# EAGLE design CAN-Bus_Shield (EAGLE 6.5.0)
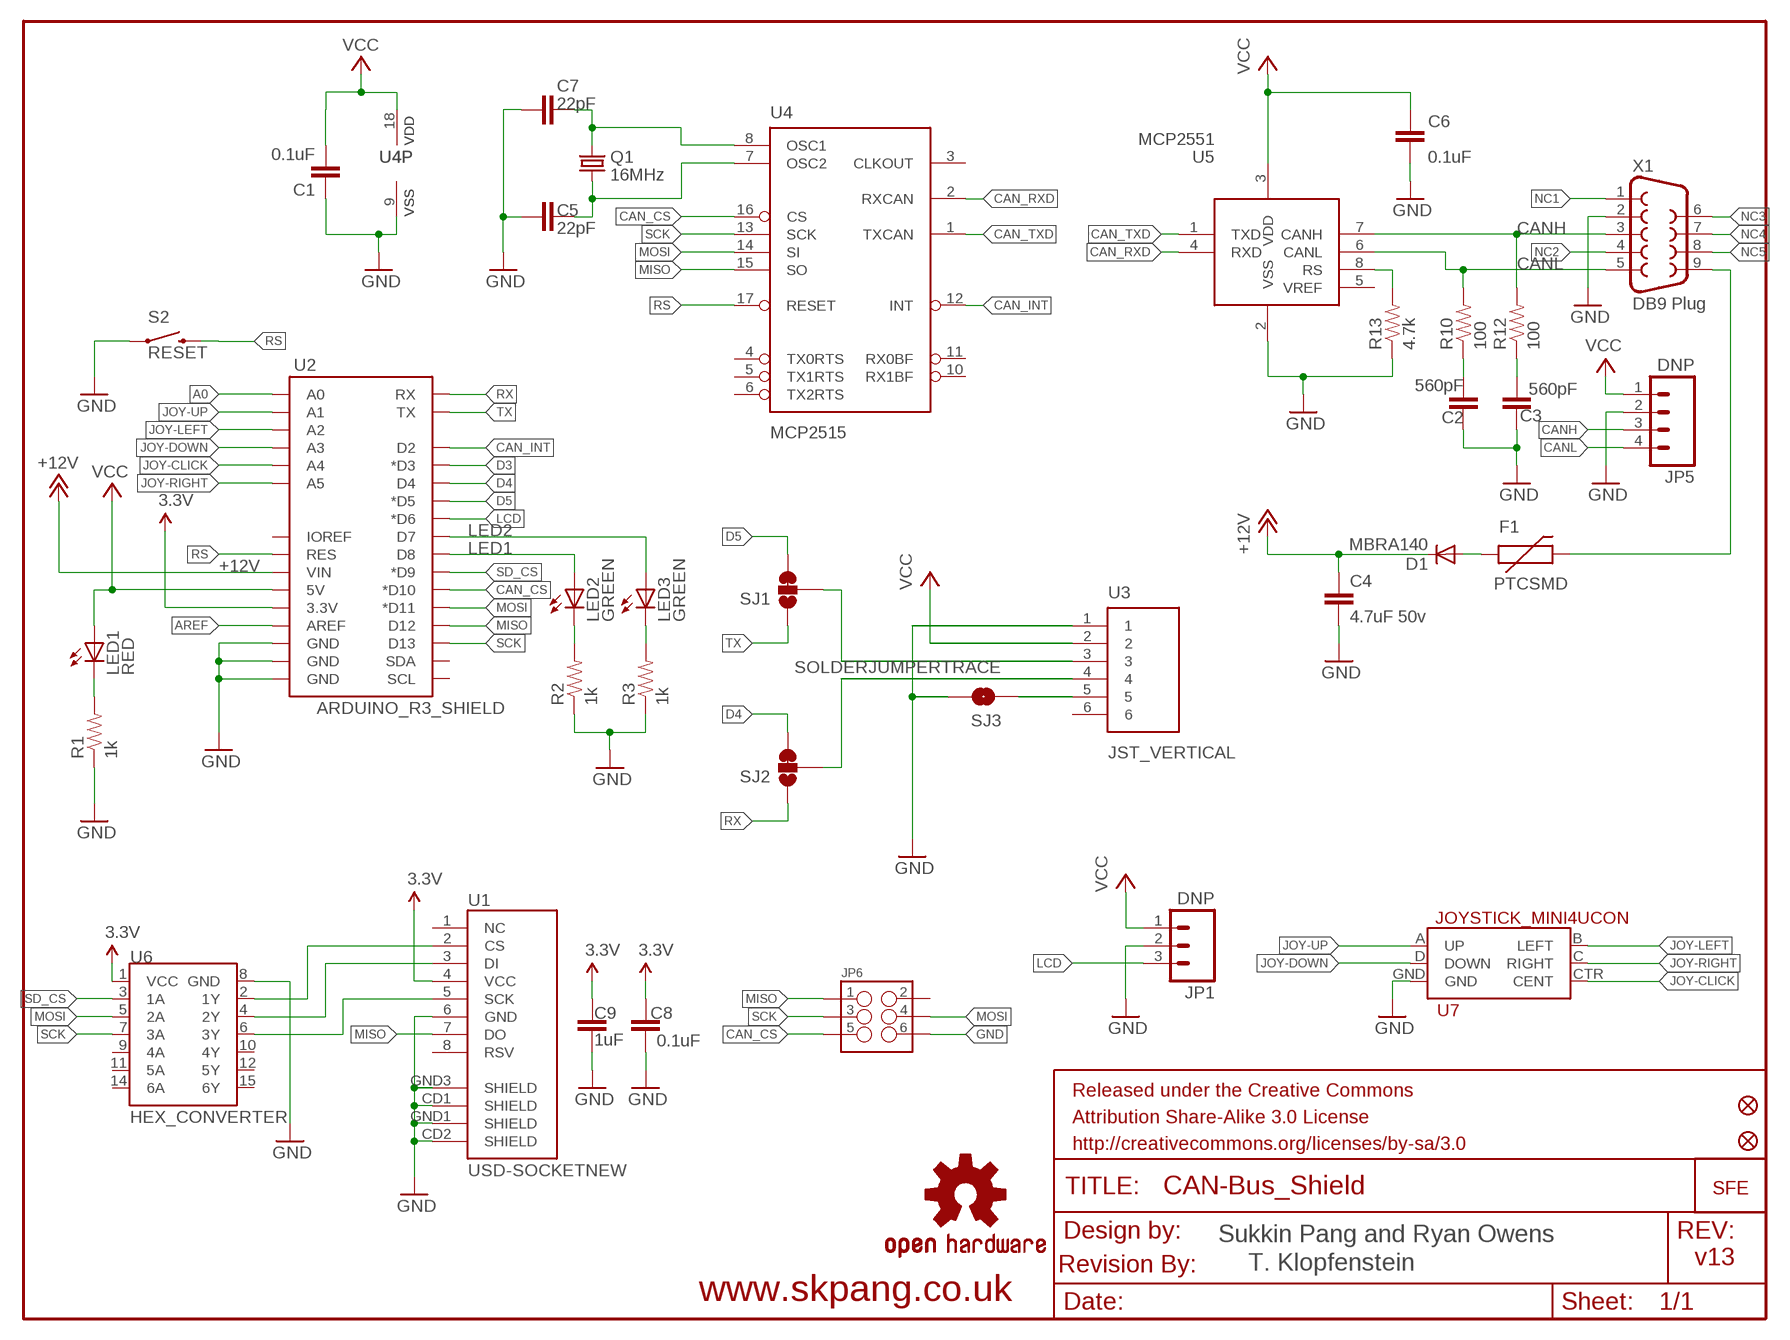
[diagram p0: schematic, sheet 1]

## Parts
C1  0.1uF  CAP0603-CAP  [0603-CAP]
C2  560pF  CAP0603-CAP  [0603-CAP]
C3  560pF  CAP0603-CAP  [0603-CAP]
C4  4.7uF 50v  CAP0603-CAP  [0603-CAP]
C5  22pF  CAP0603-CAP  [0603-CAP]
C6  0.1uF  CAP0603-CAP  [0603-CAP]
C7  22pF  CAP0603-CAP  [0603-CAP]
C8  0.1uF  CAP0603-CAP  [0603-CAP]
C9  1uF  CAP0603-CAP  [0603-CAP]
D1  MBRA140  DIODESMA  [SMA-DIODE]
F1  PTCSMD  [PTC-1206]
FRAME1  FRAME-LETTER  [CREATIVE_COMMONS]
JP1  DNP  M03POLAR_LOCK  [MOLEX-1X3_LOCK]
JP2  FIDUCIAL1X2  [FIDUCIAL-1X2]
JP3  FIDUCIAL1X2  [FIDUCIAL-1X2]
JP4  LOGO-SFENEW  [SFE-NEW-WEBLOGO]
JP5  DNP  M04PTH  [1X04]
JP6  M03X2NO_SILK  [2X3-NS]
LED1  RED  LED0603  [LED-0603]
LED2  GREEN  LED0603  [LED-0603]
LED3  GREEN  LED0603  [LED-0603]
LOGO1  OSHW-LOGOM  [OSHW-LOGO-M]
Q1  16MHz  CRYSTAL5X3  [CRYSTAL-SMD-5X3]
R1  1k  RESISTOR0603-RES  [0603-RES]
R2  1k  RESISTOR0603-RES  [0603-RES]
R3  1k  RESISTOR0603-RES  [0603-RES]
R10  100  RESISTOR0603-RES  [0603-RES]
R12  100  RESISTOR0603-RES  [0603-RES]
R13  4.7k  RESISTOR0603-RES  [0603-RES]
S2  RESET  SWITCH-MOMENTARY-2SMD  [TACTILE_SWITCH_SMD]
SJ1  SOLDERJUMPER_2WAYPASTE2&3  [SJ_3_PASTE2&3]
SJ2  SOLDERJUMPER_2WAYPASTE2&3  [SJ_3_PASTE2&3]
SJ3  SOLDERJUMPERTRACE  [SJ_2S-TRACE]
U1  USD-SOCKETNEW  [MICRO-SD-SOCKET-PP]
U2  ARDUINO_R3_SHIELD  [UNO_R3_SHIELD]
U3  JST_VERTICAL  [JST-6-SMD-VERT-1.0MM]
U4  MCP2515  MCP2510SO  [SO-18W]
U5  MCP2551  [SO-08M]
U6  HEX_CONVERTER  [SO016]
U7  JOYSTICK_MINI4UCON  [JOYSTICK_MINI]
U$1  REVISION  [REVISION]
X1  DB9 Plug  DB9MALE  [DB9_MALE]

## Nets
3.3V: C8.2 C9.1 U1.4(VCC) U2.3.3V U6.1(VCC)
+12V: C4.1 D1.C U2.VIN
A0: U2.A0
AREF: U2.AREF
CAN_CS: JP6.5 U2.D10(*D10) U4.16(CS)
CAN_INT: U2.D2 U4.12(INT)
CAN_RXD: U4.2(RXCAN) U5.4(RXD)
CAN_TXD: U4.1(TXCAN) U5.1(TXD)
CANH: JP5.3 R12.2 U5.7(CANH) X1.3
CANL: JP5.4 R10.2 U5.6(CANL) X1.5
D3: U2.D3(*D3)
D4: SJ2.3 U2.D4
D5: SJ1.3 U2.D5(*D5)
GND: C1.1 C2.1 C3.1 C4.2 C5.1 C6.1 C7.1 C8.1 C9.2 JP1.2 JP5.2 JP6.6 R1.1 R2.1 R3.1 R13.1 S2.1 SJ3.2 U1.6(GND) U1.CD1(SHIELD) U1.CD2(SHIELD) U1.GND1(SHIELD) U1.GND3(SHIELD) U2.GND@0(GND) U2.GND@1(GND) U2.GND@2(GND) U3.1 U4.9(VSS) U5.2(VSS) U6.8(GND) U7.GND X1.2
JOY-CLICK: U2.A4 U7.CTR(CENT)
JOY-DOWN: U2.A3 U7.D(DOWN)
JOY-LEFT: U2.A2 U7.B(LEFT)
JOY-RIGHT: U2.A5 U7.C(RIGHT)
JOY-UP: U2.A1 U7.A(UP)
LCD: JP1.3 U2.D6(*D6)
LED1: LED2.A U2.D8
LED2: LED3.A U2.D7
MISO: JP6.1 U1.7(DO) U2.D12 U4.15(SO)
MOSI: JP6.4 U2.D11(*D11) U4.14(SI) U6.5(2A)
N$1: SJ3.1 U3.5
N$4: LED1.C R1.2
N$5: LED2.C R2.2
N$6: LED3.C R3.2
N$9: C2.2 R10.1
N$10: C3.2 R12.1
N$13: F1.2 X1.9
N$14: R13.2 U5.8(RS)
N$15: U1.2(CS) U6.2(1Y)
N$16: D1.A F1.1
N$17: C7.2 Q1.3 U4.8(OSC1)
N$18: C5.2 Q1.1 U4.7(OSC2)
N$19: U1.3(DI) U6.4(2Y)
N$21: SJ1.2 U3.3
N$22: SJ2.2 U3.4
N$24: U1.5(SCK) U6.6(3Y)
NC1: X1.1
NC2: X1.4
NC3: X1.6
NC4: X1.7
NC5: X1.8
RS: S2.3 U2.RES U4.17(RESET)
RX: SJ2.1 U2.RX
SCK: JP6.3 U2.D13 U4.13(SCK) U6.7(3A)
SD_CS: U2.D9(*D9) U6.3(1A)
TX: SJ1.1 U2.TX
VCC: C1.2 C6.2 JP1.1 JP5.1 LED1.A U2.5V U3.2 U4.18(VDD) U5.3(VDD)
Unconnected: JP6.2 U1.1(NC) U1.8(RSV) U2.IOREF U2.SCL U2.SDA U3.6 U4.3(CLKOUT) U4.4(TX0RTS) U4.5(TX1RTS) U4.6(TX2RTS) U4.10(RX1BF) U4.11(RX0BF) U5.5(VREF) U6.9(4A) U6.10(4Y) U6.11(5A) U6.12(5Y) U6.14(6A) U6.15(6Y)

## Notes on the sheet
- Sukkin Pang and Ryan Owens
- T. Klopfenstein | v13
- www.skpang.co.uk

## Library data of the parts
C1-C9 = SparkFun:CAP: Capacitor Standard 0603 ceramic capacitor, and 0.1" leaded capacitor.
D1 = SparkFun:DIODE: Diode These are standard reverse protection diodes and small signal diodes. SMA package can handle up to about 1A. SOD-323 can handle about 200mA. What the SOD-323 package when ordering, there are some mfgs out there that are 5-pin packages.
F1 = SparkFun:PTC: Resettable Fuse PTC Resettable Fuse. Spark Fun Electronics SKU : COM-08357
FRAME1 = SparkFun-Aesthetics:FRAME-LETTER: Schematic Frame Standard 8.5x11 US Letter frame
JP1 = SparkFun:M03: Header 3 Standard 3-pin 0.1" header. Use with straight break away headers (SKU : PRT-00116), right angle break away headers (PRT-00553), swiss pins (PRT-00743), machine pins (PRT-00117), and female headers (PRT-00115). Molex polarized connector foot print use with SKU : PRT-08232 with associated crimp pins and housings.
JP2 JP3 = SparkFun:FIDUCIAL: Fiducial Alignment Points Various fiducial points for machine vision alignment.
JP4 = SparkFun:LOGO-SFE: Spark Fun Electronics PCB Logo This is the standard Spark Fun Electronics PCB logo.
JP5 = SparkFun:M04: Header 4 Standard 4-pin 0.1" header. Use with straight break away headers (SKU : PRT-00116), right angle break away headers (PRT-00553), swiss pins (PRT-00743), machine pins (PRT-00117), and female headers (PRT-00115). Molex polarized connector foot print use with SKU : PRT-08231 with associated crimp pins and housings.
JP6 = SparkFun-Connectors:M03X2: 2x3 .1" header. Shrouded, with keying- CONN-10681 SMT- CONN-11415 Pogo pins- HW-11044
LED1-LED3 = SparkFun:LED: LEDs Standard schematic elements and footprints for 5mm, 3mm, 1206, and 0603 sized LEDs. 5mm - Spark Fun Electronics SKU : COM-00529 (and others)
LOGO1 = SparkFun-Aesthetics:OSHW-LOGO: Open Source Hardware Logo This logo indicates the piece of hardware it is found on incorporates a OSHW license and/or adheres to the definition of open source hardware found here: http://freedomdefined.org/OSHW
Q1 = SparkFun:CRYSTAL: Crystals Various standard crystals. Proven footprints. Spark Fun Electronics SKU : COM-00534
R1-R3 R10 R12 R13 = SparkFun:RESISTOR: Resistor Basic schematic elements and footprints for 0603, 1206, and PTH resistors.
S2 = SparkFun:SWITCH-MOMENTARY-2
SJ1 SJ2 = SparkFun:SOLDERJUMPER_2WAY: Solder Jumper 2 way solder jumper
SJ3 = SparkFun-Passives:SOLDERJUMPER: Solder Jumper Standard SMD solder jumper. Used to automate production. Two varients : Normally Open and Normally Closed are the same, but have different paste layers. NC will have a large amount of paste and should jumper during reflow.
U1 = SparkFun:USD-SOCKET: microSD Socket Push-push type uSD socket. Schematic element and footprint production proven. Spark Fun Electronics SKU : PRT-00127. tDoc lines correctly indicate media card edge positions when inserting (unlocked, locked, depressed).
U2 = SparkFun-Boards:ARDUINO_R3_SHIELD: Shield form compatible with the Arduino Uno R3.
U3 = SparkFun-Connectors:JST_VERTICAL; PROD_ID: CONN-08249
U4 = microchip_can:MCP2510
U5 = skpang_lib:MCP2551
U6 = SparkFun:HEX_CONVERTER
U7 = SparkFun:JOYSTICK_MINI
U$1 = SparkFun-Aesthetics:REVISION
X1 = SparkFun:DB9: DB9 Connector Standard DB9 (D-Sub 9) serial connector. Can be used for CAN bus as well as RS485 and RS232. Footprint production proven. Spark Fun Electronics SKU : PRT-00429

## Board
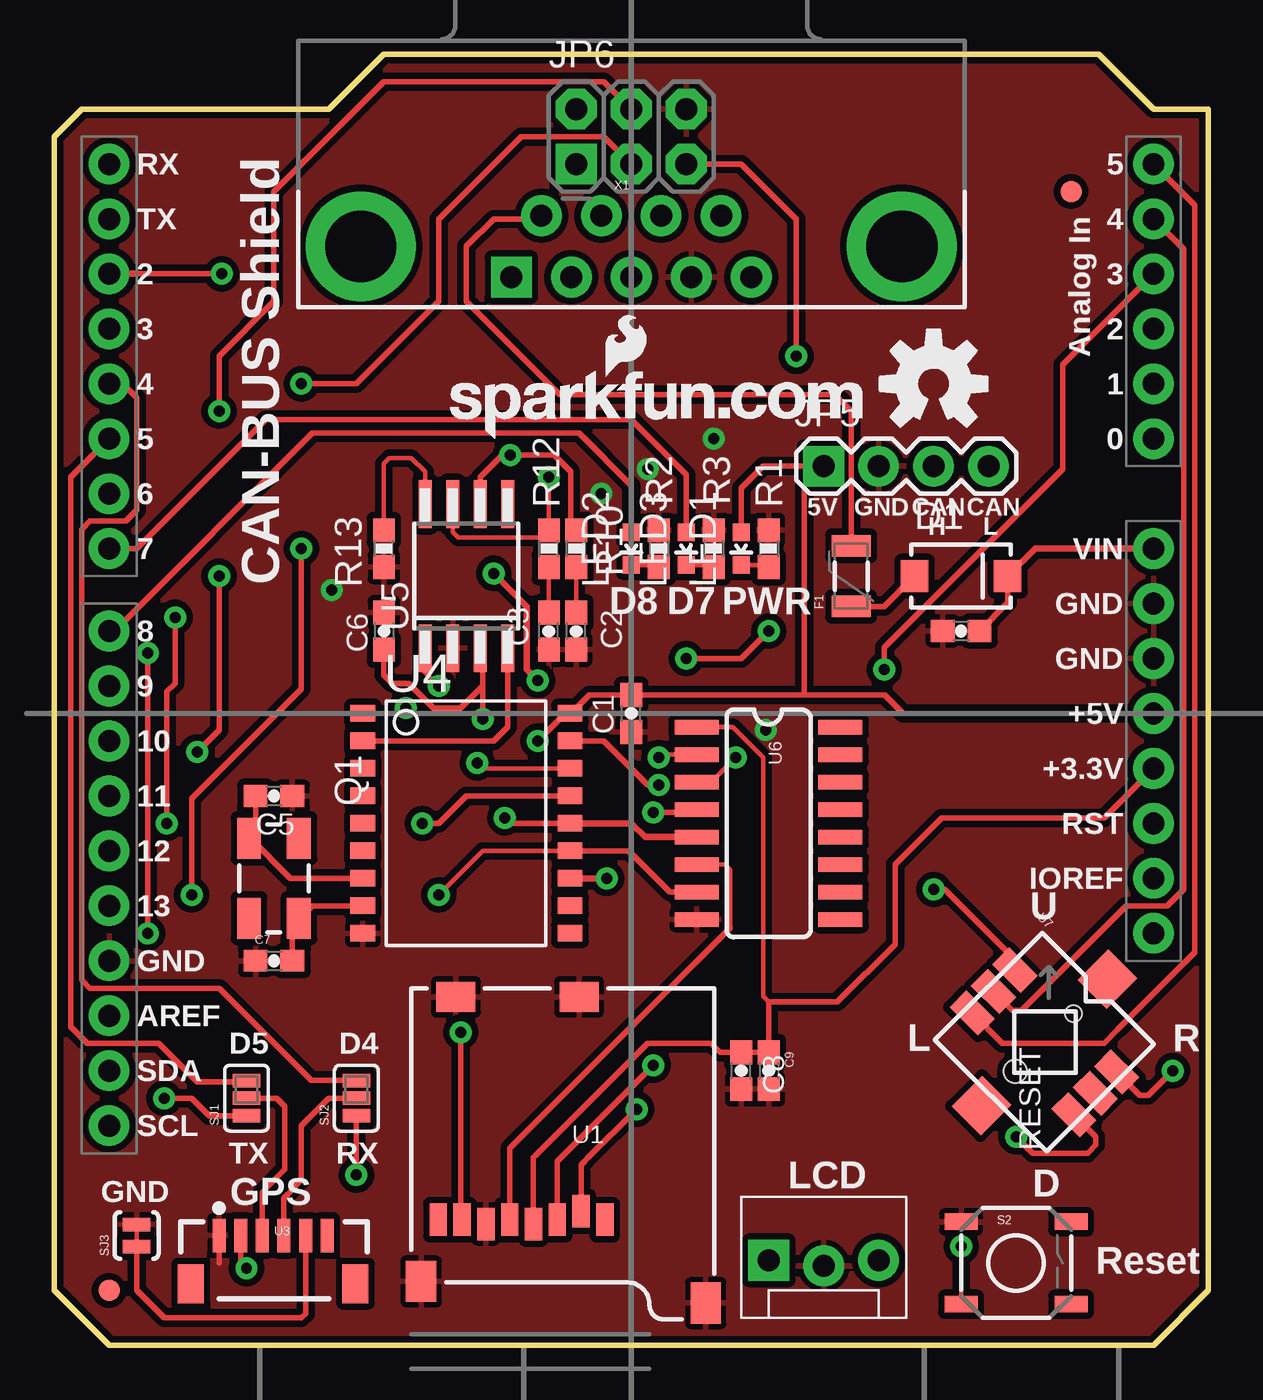
[diagram p1: board, top side]
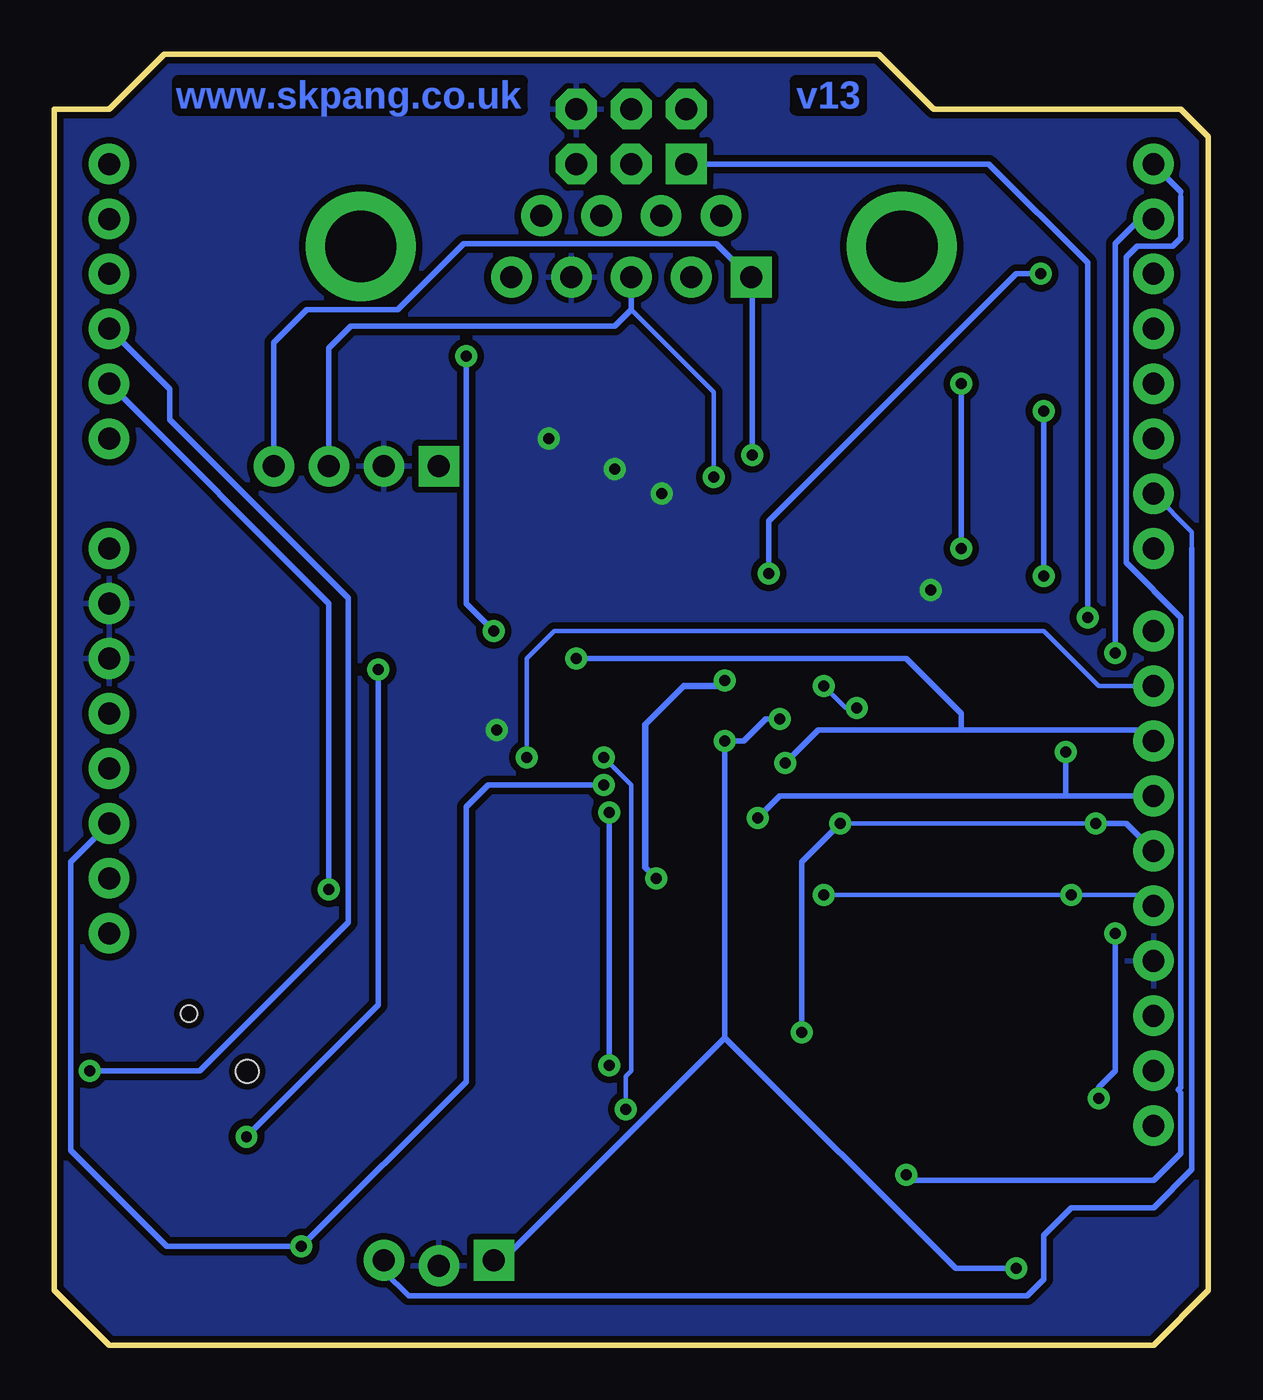
[diagram p2: board, bottom side, seen from below]

Size 53.34 x 59.69 mm. Coordinates in mm from the lower left corner, seen from the top.
Outline: 0,2.54 0,55.88 1.27,57.15 12.7,57.15 15.24,59.69 48.26,59.69 50.8,57.15 53.34,57.15 53.34,2.54 50.8,0 2.54,0 0,2.54
Copper layers (1*16): Top 0.035mm / dielectric 1.5mm / Bottom 0.035mm
Design rules "SparkFun *": minimum track width 8mil, minimum drill 20mil, track to track 8mil, track to pad 8mil, pad to pad 8mil, via to via 8mil, smd to smd 8mil, copper to edge 8mil, drill to drill 8mil, minimum pad ring 12mil, minimum via ring 10mil, stop-mask expansion 4mil, vias tented up to drill 20mil, thermal gap 10mil

### Footprints (pad centres in the part's own frame; a part is rotated, then mirrored left to right if it is on the bottom)
0603-CAP = smd 1.1 x 1: 1 -0.85,0; 2 0.85,0
SMA-DIODE = smd 1.27 x 1.47: A -2.15,0; C 2.15,0
PTC-1206 = smd 1 x 1.8: 1 -1.4,0; 2 1.4,0
MOLEX-1X3_LOCK = drill 1.016 pad 1.88 square: 1 0,0.127 | drill 1.016 pad 1.88: 2 2.54,-0.127; 3 5.08,0.127
FIDUCIAL-1X2 = smd 1 x 1: 1 0,0
1X04 = drill 1.016 pad 1.88 square: 1 0,0 | drill 1.016 pad 1.88: 2 2.54,0; 3 5.08,0; 4 7.62,0
2X3-NS = drill 1.016 pad 1.88 square: 1 -2.54,-1.27 | drill 1.016 pad 1.88 octagon: 2 -2.54,1.27; 3 0,-1.27; 4 0,1.27; 5 2.54,-1.27; 6 2.54,1.27
LED-0603 = smd 0.8 x 0.8: A 0,-0.75; C 0,0.75
CRYSTAL-SMD-5X3 = smd 1.9 x 1.1: 1 -1.85,-1.15; 2 1.85,-1.15; 3 1.85,1.15; 4 -1.85,1.15
0603-RES = smd 1.1 x 1: 1 -0.85,0; 2 0.85,0
TACTILE_SWITCH_SMD = smd 1.524 x 0.762: 1 -2.54,1.905; 2 2.54,1.905; 3 -2.54,-1.905; 4 2.54,-1.905
SJ_3_PASTE2&3 = smd 0.635 x 1.27: 1 -0.813,0; 2 0,0; 3 0.813,0
SJ_2S-TRACE = smd 0.635 x 1.27: 1 -0.508,0; 2 0.508,0
MICRO-SD-SOCKET-PP = smd 0.8 x 1.5: 1 -8.94,10.7; 2 -7.84,10.3; 3 -6.74,10.7; 4 -5.64,10.9; 5 -4.54,10.7; 6 -3.44,10.9; 7 -2.34,10.7; 8 -1.24,10.7 | smd 1.8 x 1.4: CD1 -2.05,0.4; CD2 -7.75,0.4 | smd 1.4 x 1.9: GND1 -13.6,14.55; GND3 -0.45,13.55
UNO_R3_SHIELD = drill 1.016 pad 1.88: 3.3V 50.8,26.67; 5V 50.8,29.21; A0 50.8,41.91; A1 50.8,44.45; A2 50.8,46.99; A3 50.8,49.53; A4 50.8,52.07; A5 50.8,54.61; AREF 2.54,15.24; D2 2.54,49.53; D3 2.54,46.99; D4 2.54,44.45; D5 2.54,41.91; D6 2.54,39.37; D7 2.54,36.83; D8 2.54,33.02; D9 2.54,30.48; D10 2.54,27.94; D11 2.54,25.4; D12 2.54,22.86; D13 2.54,20.32; GND@0 50.8,31.75; GND@1 50.8,34.29; GND@2 2.54,17.78; IOREF 50.8,21.59; NC 50.8,19.05; RES 50.8,24.13; RX 2.54,54.61; SCL 2.54,10.16; SDA 2.54,12.7; TX 2.54,52.07; VIN 50.8,36.83
JST-6-SMD-VERT-1.0MM = smd 0.6 x 1.55: 1 -2.54,1.27; 2 -1.54,1.27; 3 -0.54,1.27; 4 0.46,1.27; 5 1.46,1.27; 6 2.46,1.27 | smd 1.2 x 1.8: P$1 -3.84,-0.955; P$2 3.76,-0.955
SO-18W = smd 0.762 x 1.143: 1 -5.08,-4.788; 2 -3.81,-4.788; 3 -2.54,-4.788; 4 -1.27,-4.788; 5 0,-4.788; 6 1.27,-4.788; 7 2.54,-4.788; 8 3.81,-4.788; 9 5.08,-4.788; 10 5.08,4.788; 11 3.81,4.788; 12 2.54,4.788; 13 1.27,4.788; 14 0,4.788; 15 -1.27,4.788; 16 -2.54,4.788; 17 -3.81,4.788; 18 -5.08,4.788
SO-08M = smd 0.6 x 2.2: 1 -1.905,-3.33; 2 -0.635,-3.33; 3 0.635,-3.33; 4 1.905,-3.33; 5 1.905,3.33; 6 0.635,3.33; 7 -0.635,3.33; 8 -1.905,3.33
SO016 = smd 0.66 x 2.032: 1 -4.445,-3.315; 2 -3.175,-3.315; 3 -1.905,-3.315; 4 -0.635,-3.315; 5 0.635,-3.315; 6 1.905,-3.315; 7 3.175,-3.315; 8 4.445,-3.315; 9 4.445,3.315; 10 3.175,3.315; 11 1.905,3.315; 12 0.635,3.315; 13 -0.635,3.315; 14 -1.905,3.315; 15 -3.175,3.315; 16 -4.445,3.315
JOYSTICK_MINI = smd 1.85 x 1.1: A 0,2.8; B 6.65,2.8; C 0,0; CTR 0,1.4; D 6.65,0; GND 6.65,1.4 | smd 1.9 x 2: NC 3.325,5.53; NC@0 3.33,-2.72 | hole 0.75: 3.34,3.295 | hole 1.05: 3.325,-0.5
DB9_MALE = drill 1.016 pad 1.88: 1 5.54,-1.42; 2 2.77,-1.42; 3 0,-1.42; 4 -2.77,-1.42; 6 4.15,1.42; 7 1.38,1.42; 8 -1.38,1.42; 9 -4.15,1.42 | drill 1.016 pad 1.88 square: 5 -5.54,-1.42 | drill 3.302 pad 5.08: G1 -12.5,0; G2 12.5,0

### Placement (x,y rotation side)
C1  26.67,29.21 90 top
C2  24.13,33.02 90 top
C3  22.86,33.02 90 top
C4  41.91,33.02 180 top
C5  10.16,25.4 180 top
C6  15.24,33.02 270 top
C7  10.16,17.78 0 top
C8  31.75,12.7 90 top
C9  33.02,12.7 270 top
D1  41.91,35.56 0 top
F1  36.83,35.56 90 top
FRAME1  -7.9,-24.13 0 top  (outside the outline)
JP1  33.02,3.81 0 top
JP2  2.54,2.54 0 top
JP3  46.99,53.34 0 top
JP4  18.29,41.91 0 top
JP5  35.56,40.64 0 top
JP6  26.67,55.88 0 top
LED1  31.75,36.83 180 top
LED2  26.67,36.83 180 top
LED3  29.21,36.83 180 top
LOGO1  40.64,44.45 0 top
Q1  10.16,21.59 270 top
R1  33.02,36.83 270 top
R2  27.94,36.83 270 top
R3  30.48,36.83 270 top
R10  24.13,36.83 90 top
R12  22.86,36.83 90 top
R13  15.24,36.83 90 top
S2  44.45,3.81 0 top
SJ1  8.89,11.43 90 top
SJ2  13.97,11.43 90 top
SJ3  3.81,5.08 90 top
U1  16.51,16.51 180 top
U2  0,0 0 top
U3  10.16,3.81 0 top
U4  19.05,24.13 270 top
U5  19.05,35.56 0 top
U6  33.02,24.13 270 top
U7  42.42,15.37 315 top
U$1  3.81,-27.94 0 top  (outside the outline)
X1  26.67,50.8 0 top

### Tracks (layer width: path | path; a pad name or v marks a point on that pad's centre or on a via)
3.3V
  Top 0.203: U6.1 31.37,28.57 31.5,28.45 32.77,27.18 32.77,16.13 33.02,15.88 | 27.43,13.97 27.56,13.97 | C9.1 33.02,13.46 32.93,13.55
  Top 0.254: 27.43,13.97 22.35,8.89 22.23,8.76 22.15,8.69 U1.4 | 27.56,13.97 30.35,13.97 30.77,13.55 C8.2 32.93,13.55 | C9.1 33.02,15.88 36.2,15.88 38.86,18.54 38.86,22.23 41.02,24.38 48.51,24.38 U2.3.3V
+12V
  Top 0.254: D1.C 44.07,35.43 44.07,34.33 C4.1
  Top 0.305: U2.VIN 50.04,36.83 46.48,36.83 46.35,36.83 46.1,36.83 45.33,36.83 D1.C
CAN_CS  (via drill 0.51)
  Top 0.203: v19.56,26.92 19.68,26.92 19.94,26.67 U4.16
  Top 0.254: JP6.5 31.75,54.61 34.29,52.07 v34.29,45.72 | v29.21,31.75 31.75,31.75 v33.02,33.02
  Bottom 0.254: v34.29,45.72 34.29,34.29 v33.02,33.02 | v29.21,31.75 13.97,31.75 11.43,29.21 11.43,28.45 | v19.56,26.92 18.03,28.45 11.43,28.45 | 11.43,28.45 3.05,28.45 U2.D10
CAN_INT  (via drill 0.51)
  Top 0.254: 3.68,49.53 v7.75,49.53
  Top 0.305: U4.12 v25.53,21.59 | v22.35,30.73 21.84,31.24 21.84,34.16 v20.32,35.69 | 3.68,49.53 U2.D2
  Bottom 0.254: v20.32,35.69 20.32,38.1 8.89,49.53 v7.75,49.53
  Bottom 0.305: v22.35,30.73 22.61,30.48 24.26,30.48 26.04,28.7 26.04,22.1 v25.53,21.59
CAN_RXD
  Top 0.203: 17.78,27.94 18.8,27.94
  Top 0.254: U4.2 17.78,27.94 20.32,27.94 20.95,28.57 20.95,30.1 U5.4
CAN_TXD  (via drill 0.51)
  Top 0.203: v17.78,30.48 17.02,31.24 | U4.1 16,29.21 v16.26,29.46
  Top 0.254: 17.02,31.24 17.02,32.1 U5.1
  Bottom 0.203: v16.26,29.46 16.76,29.46 v17.78,30.48
CANH  (via drill 0.51)
  Top 0.203: 22.61,37.34 18.67,37.34 18.41,37.59 U5.7 | R12.2 v22.86,40.13
  Top 0.254: 22.61,37.34 22.61,37.43 R12.2
  Bottom 0.203: v22.86,40.13 22.86,44.07 26.67,47.88
  Bottom 0.254: X1.3 26.67,47.88 27.43,47.12 39.62,47.12 40.64,46.1 JP5.3
CANL  (via drill 0.51)
  Top 0.254: U5.6 19.68,40.13 20.7,41.15 v21.08,41.15 23.11,41.15 23.88,40.39 23.88,38.1 23.88,37.93 R10.2
  Bottom 0.254: JP5.4 43.18,46.35 41.66,47.88 37.47,47.88 34.42,50.93 22.73,50.93 21.19,49.38 X1.5 21.13,49.32 21.08,49.28 v21.08,41.15
D4
  Top 0.203: 3.81,42.93 3.81,43.05
  Top 0.254: 3.81,42.93 3.81,38.61 3.3,38.1 1.65,38.1 1.27,37.72 1.27,16.89 1.65,16.51 7.62,16.51 11.89,12.24 SJ2.3 | U2.D4 3.17,44.45 3.81,43.81 3.81,43.05
D5
  Top 0.254: U2.D5 0.76,40.13 0.76,14.73 1.52,13.97 4.83,13.97 6.6,12.19 8.84,12.19 SJ1.3
GND  (via drill 0.51)
  Top 0.254: U3.1 7.62,3.81
  other vias: 32.89,28.45 27.43,40.51 25.27,39.37 12.83,34.92 30.48,41.91
  pour Bottom (isolate 0.305): 0,0 0,59.69 53.34,59.69 53.34,0
  pour Top (isolate 0.305): 0,0 0,59.69 53.34,59.69 53.34,0
JOY-CLICK
  Top 0.254: U2.A4 52.2,50.67 52.2,21.08 51.44,20.32 49.53,20.32 44.7,15.49 44.27,15.49 | 43.41,16.28 U7.CTR 44.27,15.49 | 44.27,15.49
JOY-DOWN  (via drill 0.51)
  Top 0.254: U2.A3 46.61,45.34 46.61,40.51 38.35,32.26 v38.35,31.24 | U7.D | U7.D 48.13,9.65 48.13,9.27 47.75,8.89 45.21,8.89 v44.45,9.65
  Bottom 0.254: v38.35,31.24 38.35,15.75 v44.45,9.65
JOY-LEFT  (via drill 0.51)
  Top 0.254: U7.B 49.1,12.62 50.16,11.56 50.55,11.56 v51.69,12.7
  Bottom 0.254: U2.A2 48.01,44.2 48.01,42.8 39.75,34.54 39.75,19.56 46.61,12.7 v51.69,12.7
JOY-RIGHT
  Top 0.254: U2.A5 52.7,52.7 52.7,23.5 52.7,21.75 52.7,18.16 49.15,14.61 48.51,13.97 45.72,13.97 45.47,13.97 43.81,13.97 U7.C
JOY-UP  (via drill 0.51)
  Top 0.254: 40.64,21.11 v40.64,21.08 41.15,21.08 44.4,17.83 U7.A
  Bottom 0.254: v40.64,21.08 40.64,34.29 U2.A1
LCD
  Bottom 0.203: U2.D6 0.76,37.59 0.76,36.83
  Bottom 0.254: 0.76,36.83 0.76,8.13 2.54,6.35 6.35,6.35 7.62,5.08 7.62,3.05 8.38,2.29 36.96,2.29 38.1,3.43 JP1.3
LED1
  Top 0.254: U2.D8 2.79,33.02 11.94,42.16 24.26,42.16 26.67,39.75 LED2.A
LED2
  Top 0.254: 28.96,37.34 29.21,37.34 LED3.A 29.21,40.26 26.67,42.8 9.78,42.8 3.81,36.83 U2.D7
MISO  (via drill 0.51)
  Top 0.203: 23.37,25.4 U4.15
  Top 0.254: v18.8,14.48 18.8,5.86 U1.7 | 23.37,25.4 19.05,25.4 17.78,24.13 v17.02,24.13 | v5.21,24.13 5.21,30.23 5.59,30.61 v5.59,33.66
  Bottom 0.203: v17.02,24.13 v5.21,24.13
  Bottom 0.254: v18.8,14.48 18.8,22.35 v17.02,24.13 | JP6.1 10.16,54.61 5.59,50.04 v5.59,33.66 | v5.21,24.13 3.81,24.13 U2.D12
MOSI  (via drill 0.51)
  Top 0.254: U4.14 21.08,24.13 v20.83,24.38 | JP6.4 25.4,58.42 15.24,58.42 10.16,53.34 10.16,48.26 7.62,45.72 v7.62,43.18 | v7.62,35.56 7.62,28.45 v6.6,27.43
  Top 0.305: U6.5 27.3,23.5 26.67,24.13 U4.14
  Bottom 0.254: v20.83,24.38 19.81,25.4 6.6,25.4 | U2.D11 6.6,25.4 | v7.62,43.18 v7.62,35.56 | v6.6,27.43 6.6,25.4
N$1
  Top 0.254: U3.5 11.62,1.46 11.43,1.27 5.08,1.27 3.81,2.54 SJ3.1
N$4
  Top 0.203: 32,36.07 32.77,36.07
  Top 0.254: 32,36.07 31.76,36.07 LED1.C | 32.77,36.07 32.93,36.07 R1.2
N$5
  Top 0.203: 26.92,36.07 27.69,36.07
  Top 0.254: 26.92,36.07 26.68,36.07 LED2.C | 27.69,36.07 27.85,36.07 R2.2
N$6
  Top 0.203: 29.46,36.07 30.23,36.07
  Top 0.254: 29.46,36.07 29.22,36.07 LED3.C | 30.23,36.07 30.39,36.07 R3.2
N$9
  Top 0.203: C2.2 24.13,34.29 24.13,35.56 R10.1
N$10
  Top 0.203: C3.2 22.86,34.29 22.86,35.56 R12.1
N$13
  Top 0.254: F1.2 36.83,43.18 36.07,43.94 23.37,43.94 19.05,48.26 19.05,50.8 20.32,52.07 22.37,52.07 X1.9
N$14
  Top 0.203: R13.2 15.24,40.77 15.49,41.02 16.51,41.02 17.14,40.39 U5.8
N$15  (via drill 0.51)
  Top 0.203: U6.2 28.07,27.3 v27.94,27.18
  Top 0.254: v26.92,10.92 24.64,8.64 24.51,8.51 24.35,8.35 U1.2
  Bottom 0.203: v26.92,10.92 26.92,12.45 26.67,12.7 26.67,25.91 v27.94,27.18
N$16
  Top 0.254: D1.A 38.35,34.16 F1.1
N$17
  Top 0.254: U4.8 11.94,20.32 11.3,19.68 11.31,19.69 Q1.3 11.31,19.8 11.3,19.81 11.01,19.52 C7.2
N$18
  Top 0.254: U4.7 10.92,21.59 9.02,23.5 9.01,23.49 Q1.1 9.01,23.38 9.02,23.37 9.31,23.66 C5.2
N$19  (via drill 0.51)
  Top 0.254: v27.69,12.95 23.25,8.52 U1.3 | v27.69,24.64 29.58,24.64 U6.4
  Bottom 0.254: v27.69,12.95 v27.69,24.64
N$21
  Top 0.254: SJ1.2 10.29,11.43 10.67,11.05 10.67,8.13 9.62,7.08 U3.3
N$22
  Top 0.254: SJ2.2 12.7,11.43 11.43,10.16 11.43,7.62 10.79,6.99 10.62,6.81 U3.4
N$24
  Top 0.203: 31.24,19.3 31.24,21.34 31.24,21.59 31.24,21.97 30.99,22.23 U6.6
  Top 0.254: 31.24,19.3 21.34,9.4 21.21,9.27 21.05,9.11 U1.5
RS  (via drill 0.51)
  Top 0.203: v41.91,4.57 41.91,2.03 S2.3
  Top 0.254: v27.94,25.91 27.43,25.91 25.65,27.69 25.4,27.94 U4.17
  Bottom 0.254: v27.94,25.91 33.27,25.91 34.29,24.89 34.29,12.19 v41.91,4.57 42.04,4.57 48.13,4.57 52.58,9.02 52.58,12.19 52.58,22.35 U2.RES
RX  (via drill 0.51)
  Top 0.254: SJ2.1 v13.97,7.87
  Bottom 0.203: 1.27,53.09 1.27,53.34
  Bottom 0.254: 1.27,53.09 1.27,51.18 1.65,50.8 3.3,50.8 3.81,50.29 3.81,36.2 1.27,33.66 1.27,11.94 1.4,11.81 1.27,11.68 1.27,8.89 2.54,7.62 13.72,7.62 v13.97,7.87 | 1.27,53.34 U2.RX
SCK  (via drill 0.51)
  Top 0.203: 24.38,22.86 U4.13 19.81,22.86 v17.78,20.83
  Top 0.254: 24.38,22.86 26.54,22.86 28.45,20.95 U6.7 | JP6.3 25.4,55.88 21.59,55.88 17.78,52.07 17.78,48.26 13.97,44.45 v11.43,44.45 | v6.35,20.83 6.35,25.27 11.43,30.35 v11.43,36.83
  Bottom 0.203: v17.78,20.83 v6.35,20.83 3.05,20.83 U2.D13
  Bottom 0.254: v11.43,44.45 v11.43,36.83
SD_CS  (via drill 0.51)
  Top 0.203: v31.5,27.18 30.48,26.16
  Top 0.254: U6.3 30.35,26.04 30.48,26.16
  Bottom 0.203: v31.5,27.18 31.5,31.75 30.23,33.02 7.62,33.02 5.08,30.48 U2.D9
TX  (via drill 0.51)
  Top 0.254: v4.32,19.05 v4.32,32 | SJ1.1 7.16,10.62 6.35,11.43 v5.08,11.43
  Bottom 0.254: v4.32,32 4.32,50.93 3.17,52.07 U2.TX | v5.08,11.43 5.08,11.94 4.32,12.7 v4.32,19.05
VCC  (via drill 0.51)
  Top 0.254: v22.35,27.94 23.37,28.96 23.58,28.96 U4.18 23.88,29.21 24.73,30.06 C1.2 34.67,30.06 | C6.2 15.24,30.99 15.62,30.61 16.38,30.61 17.53,29.46 18.8,29.46 19.81,30.48 | 34.67,30.06 38.39,30.06 39.24,29.21 U2.5V | v8.89,3.56 8.62,3.83 U3.2 | 34.67,30.06 34.67,39.75 JP5.1 32.77,40.64 31.75,39.62 LED1.A | 19.81,30.48 v19.81,28.96 | 19.81,30.48 19.81,32.1 U5.3
  Bottom 0.203: 22.1,27.94 v22.35,27.94 22.61,28.19
  Bottom 0.254: 22.35,14.22 v22.35,27.94 | 22.35,14.22 32.64,3.94 JP1.1 | v8.89,3.56 11.68,3.56 22.35,14.22 | 22.1,27.94 21.46,27.94 20.45,28.96 v19.81,28.96

### Text on the board
Bottom: www.skpang.co.uk | v13
tPlace: 5V | GND | CAN | CAN | H | L | CAN-BUS Shield | D8 | D7 | PWR | U | L | R | D5 | D4 | TX | RX | GND | LCD | D | GPS | Reset
tNames: RESET
tValues: Sukking Pang and Ryan Owens | T. Klopfenstein